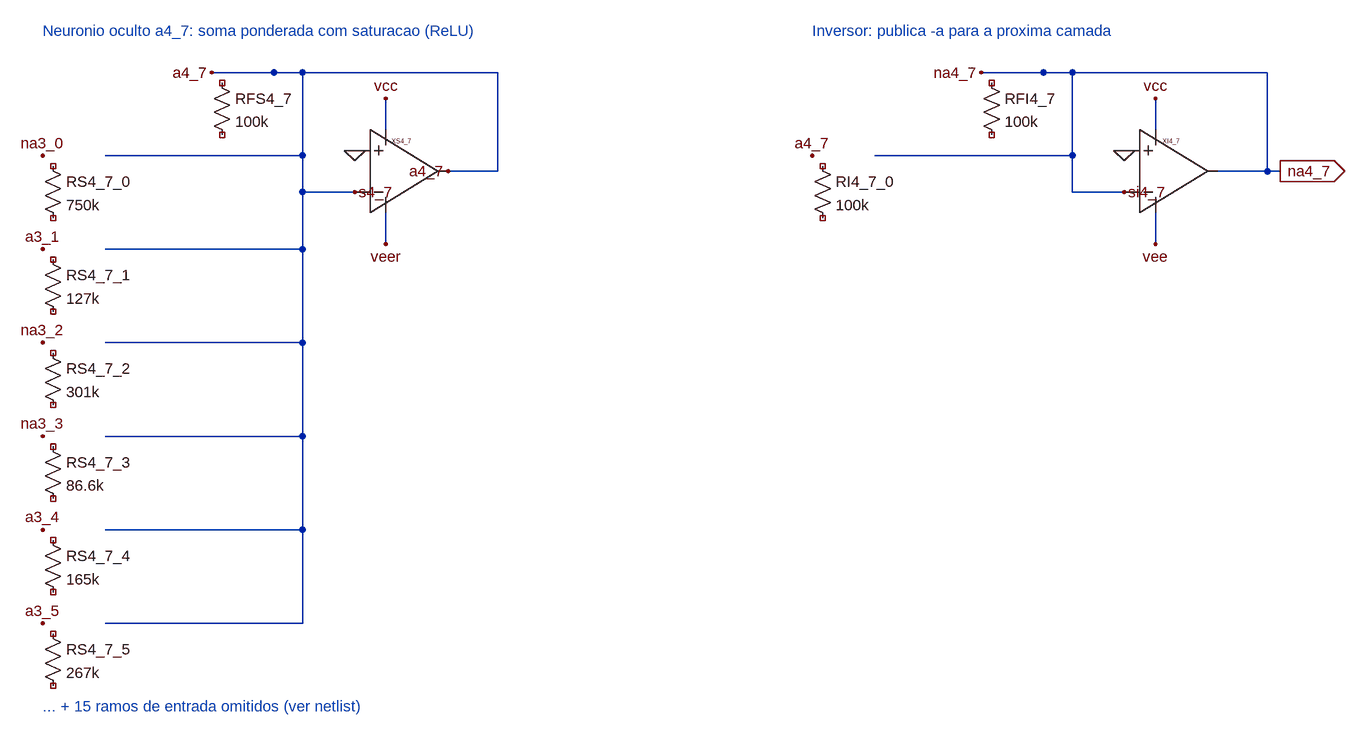
[diagram p0: schematic neuronio_oculto.asc]
neuronio_oculto.asc, the LTspice schematic file:
Version 4
SHEET 1 2235 1237
WIRE 624 184 624 136
WIRE 624 312 624 360
WIRE 452 96 496 96
WIRE 720 248 796 248
WIRE 796 248 796 96
WIRE 796 96 356 96
WIRE 192 224 496 224
WIRE 192 368 496 368
WIRE 192 512 496 512
WIRE 192 656 496 656
WIRE 192 800 496 800
WIRE 192 944 496 944
WIRE 496 96 496 944
WIRE 496 280 576 280
WIRE 1808 184 1808 136
WIRE 1808 312 1808 360
WIRE 1636 96 1680 96
WIRE 1904 248 1980 248
WIRE 1980 248 1980 96
WIRE 1980 96 1540 96
WIRE 1376 224 1680 224
WIRE 1680 96 1680 280
WIRE 1680 280 1760 280
WIRE 1904 248 2000 248
SYMBOL opamp2 576 184 R0
SYMATTR InstName XS4_7
SYMATTR Value CLAW_IDEAL_OPAMP
SYMBOL res 356 96 R0
SYMATTR InstName RFS4_7
SYMATTR Value 100k
SYMBOL res 96 224 R0
SYMATTR InstName RS4_7_0
SYMATTR Value 750k
SYMBOL res 96 368 R0
SYMATTR InstName RS4_7_1
SYMATTR Value 127k
SYMBOL res 96 512 R0
SYMATTR InstName RS4_7_2
SYMATTR Value 301k
SYMBOL res 96 656 R0
SYMATTR InstName RS4_7_3
SYMATTR Value 86.6k
SYMBOL res 96 800 R0
SYMATTR InstName RS4_7_4
SYMATTR Value 165k
SYMBOL res 96 944 R0
SYMATTR InstName RS4_7_5
SYMATTR Value 267k
SYMBOL opamp2 1760 184 R0
SYMATTR InstName XI4_7
SYMATTR Value CLAW_IDEAL_OPAMP
SYMBOL res 1540 96 R0
SYMATTR InstName RFI4_7
SYMATTR Value 100k
SYMBOL res 1280 224 R0
SYMATTR InstName RI4_7_0
SYMATTR Value 100k
FLAG 576 216 0
FLAG 624 136 vcc
FLAG 624 360 veer
FLAG 356 96 a4_7
FLAG 96 224 na3_0
FLAG 96 368 a3_1
FLAG 96 512 na3_2
FLAG 96 656 na3_3
FLAG 96 800 a3_4
FLAG 96 944 a3_5
FLAG 576 280 s4_7
FLAG 720 248 a4_7
FLAG 1760 216 0
FLAG 1808 136 vcc
FLAG 1808 360 vee
FLAG 1540 96 na4_7
FLAG 1280 224 a4_7
FLAG 1760 280 si4_7
FLAG 2000 248 na4_7
IOPIN 2000 248 Out
TEXT 96 32 Left 2 ;Neuronio oculto a4_7: soma ponderada com saturacao (ReLU)
TEXT 1280 32 Left 2 ;Inversor: publica -a para a proxima camada
TEXT 96 1072 Left 2 ;... + 15 ramos de entrada omitidos (ver netlist)

The netlist it stands for:
* neuronio_oculto.asc
XXS4_7 CLAW_IDEAL_OPAMP CLAW_IDEAL_OPAMP
RFS4_7 NC_01 NC_02 100k
RS4_7_0 NC_03 NC_04 750k
RS4_7_1 NC_05 NC_06 127k
RS4_7_2 NC_07 NC_08 301k
RS4_7_3 NC_09 NC_10 86.6k
RS4_7_4 NC_11 NC_12 165k
RS4_7_5 NC_13 NC_14 267k
XXI4_7 CLAW_IDEAL_OPAMP CLAW_IDEAL_OPAMP
RFI4_7 NC_15 NC_16 100k
RI4_7_0 NC_17 NC_18 100k
* Neuronio oculto a4_7: soma ponderada com saturacao (ReLU)
* Inversor: publica -a para a proxima camada
* ... + 15 ramos de entrada omitidos (ver netlist)
.backanno
.end